# Altium project Shield.PrjPCB
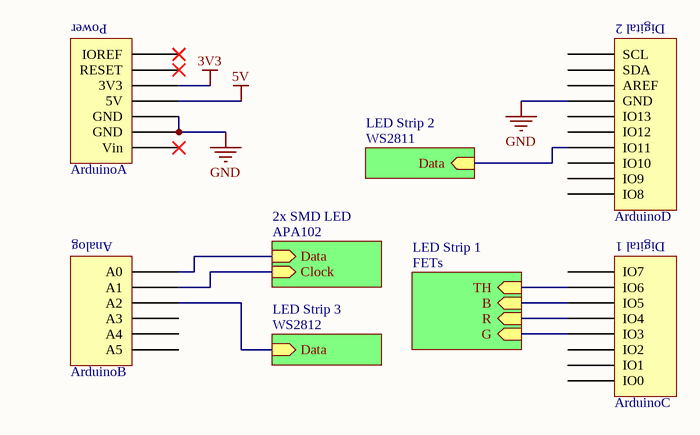
[diagram p0: Top.SchDoc]
5 sheets, 18 parts. Net scope: hierarchical (ports join the sheet entries above them; power ports are global).
Board file: Shield.PcbDoc
Sheets:
  Top.SchDoc
    2x SMD LED = APA102.SchDoc
    LED Strip 2 = WS2811.SchDoc
    LED Strip 1 = FETs.SchDoc
    LED Strip 3 = WS2812.SchDoc

## Sheet Top.SchDoc
size A4

### Parts
Arduino  Uno  [Arduino Uno]  (value not drawn)  (parts A,B,C,D of 5)

### Sub-sheets
2x SMD LED = APA102: Data (in), Clock (in)
LED Strip 1 = FETs: B (in), G (in), R (in), TH (in)
LED Strip 2 = WS2811: Data (in)
LED Strip 3 = WS2812: Data (in)

### Nets
3V3: Arduino.3V3
5V: Arduino.5V
GND: Arduino.GND1(GND) Arduino.GND2(GND) Arduino.GND3(GND)
APA102-Clock: Arduino.A1 ; sheet 2x SMD LED/Clock
APA102-Data: Arduino.A0 ; sheet 2x SMD LED/Data
Gate-B: Arduino.5(IO5) ; sheet LED Strip 1/B
Gate-G: Arduino.3(IO3) ; sheet LED Strip 1/G
Gate-R: Arduino.4(IO4) ; sheet LED Strip 1/R
Gate-TH: Arduino.6(IO6) ; sheet LED Strip 1/TH
WS2811-Data: Arduino.11(IO11) ; sheet LED Strip 2/Data
NetArduino_A2: Arduino.A2 ; sheet LED Strip 3/Data

Not connected (* = marked no-connect by the designer): Arduino 0(IO0) 1(IO1) 2(IO2) 7(IO7) 8(IO8) 9(IO9) 10(IO10) 12(IO12) 13(IO13) A3 A4 A5 AREF IOREF* RESET* SCL SDA Vin*

### Notes on the sheet
- (in symbol Arduino Uno, part A) Power
- (in symbol Arduino Uno, part B) Analog
- (in symbol Arduino Uno, part C) Digital 1
- (in symbol Arduino Uno, part D) Digital 2
- (in symbol Arduino Uno, part E) ICSP

### Library data of the parts
Arduino = Arduino Uno

## Sheet APA102.SchDoc
size A4
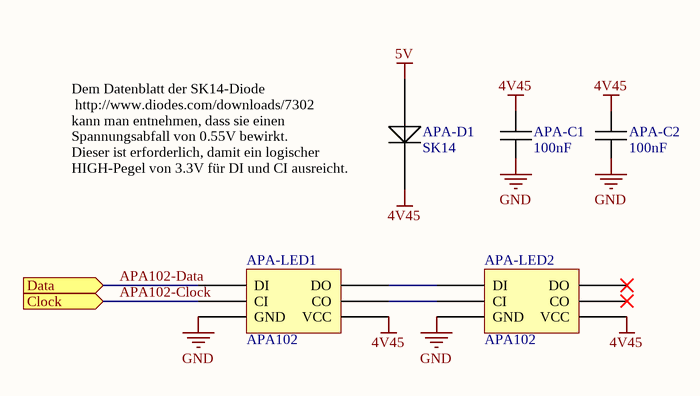
[diagram p1: APA102.SchDoc]

### Parts
APA-C1  100nF  [C 0805 wide]
APA-C2  100nF  [C 0805 wide]
APA-D1  SK14  [SC-90]
APA-LED1  APA102  [LED SMD 5x5mm]
APA-LED2  APA102  [LED SMD 5x5mm]

### Ports
Clock (in), Data (in)

### Nets
4V45: APA-C1.1 APA-C2.1 APA-D1.1 APA-LED1.4(VCC) APA-LED2.4(VCC)
5V: APA-D1.2
GND: APA-C1.2 APA-C2.2 APA-LED1.3(GND) APA-LED2.3(GND)
APA102-Clock: APA-LED1.2(CI) ; port Clock
APA102-Data: APA-LED1.1(DI) ; port Data
NetAPA-LED1_5: APA-LED1.5(CO) APA-LED2.2(CI)
NetAPA-LED1_6: APA-LED1.6(DO) APA-LED2.1(DI)

Not connected (* = marked no-connect by the designer): APA-LED2 5(CO)* 6(DO)*

### Notes on the sheet
- (near APA-D1) Dem Datenblatt der SK14-Diode
  http://www.diodes.com/downloads/7302
  kann man entnehmen, dass sie einen
  Spannungsabfall von 0.55V bewirkt.
  Dieser ist erforderlich, damit ein logischer
  HIGH-Pegel von 3.3V für DI und CI ausreicht.

### Library data of the parts
APA-C1 APA-C2 = Capacitor
APA-D1 = Diode

## Sheet WS2811.SchDoc
size A4
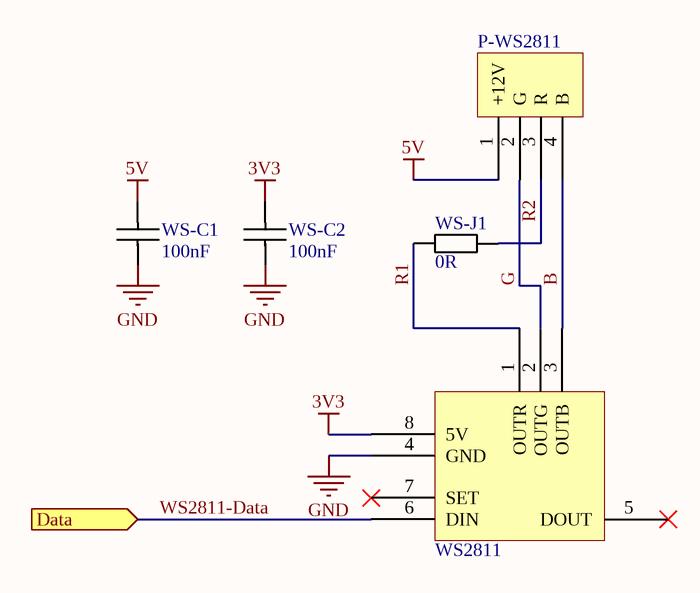
[diagram p2: WS2811.SchDoc]

### Parts
P-WS2811  LED strip RGB  [LED strip RGB connector]  (value not drawn)
WS2811  WS2811S  [SOIC-8]  (value not drawn)
WS-C1  100nF  [C 0805 / 2012]
WS-C2  100nF  [C 0805 / 2012]
WS-J1  0R  [R 0805 / 2012 wide]

### Ports
Data (in)

### Nets
3V3: WS2811.8(5V) WS-C2.1
5V: P-WS2811.1(+12V) WS-C1.1
GND: WS2811.4(GND) WS-C1.2 WS-C2.2
B: P-WS2811.4(B) WS2811.3(OUTB)
G: P-WS2811.2(G) WS2811.2(OUTG)
R1: WS2811.1(OUTR) WS-J1.1
R2: P-WS2811.3(R) WS-J1.2
WS2811-Data: WS2811.6(DIN) ; port Data

Not connected (* = marked no-connect by the designer): WS2811 5(DOUT)* 7(SET)*

### Library data of the parts
WS2811 = WS2811S: RGB LED Controller
WS-C1 WS-C2 = Capacitor
WS-J1 = Resistor

## Sheet FETs.SchDoc
size A4
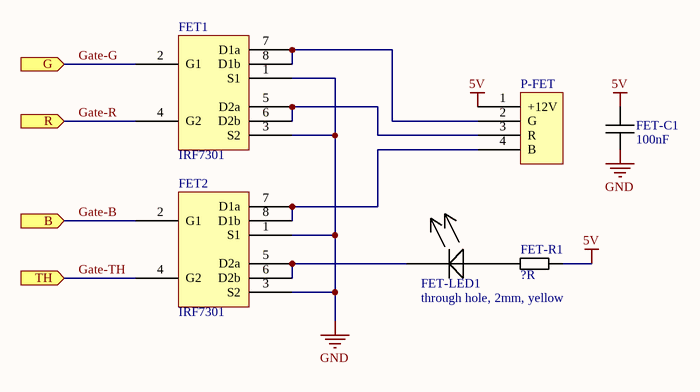
[diagram p3: FETs.SchDoc]

### Parts
FET1  IRF7301  [SOIC-8]
FET2  IRF7301  [SOIC-8]
FET-C1  100nF  [C 0805 / 2012]
FET-LED1  through hole, 2mm, yellow  [LED 3mm]
FET-R1  ?R  [R 0805 / 2012]
P-FET  LED strip RGB  [LED strip RGB connector]  (value not drawn)

### Ports
B (in), G (in), R (in), TH (in)

### Nets
5V: FET-C1.1 FET-R1.2 P-FET.1(+12V)
GND: FET1.1(S1) FET1.3(S2) FET2.1(S1) FET2.3(S2) FET-C1.2
Gate-B: FET2.2(G1) ; port B
Gate-G: FET1.2(G1) ; port G
Gate-R: FET1.4(G2) ; port R
Gate-TH: FET2.4(G2) ; port TH
NetFET1_5: FET1.5(D2a) FET1.6(D2b) P-FET.3(R)
NetFET1_7: FET1.7(D1a) FET1.8(D1b) P-FET.2(G)
NetFET2_5: FET2.5(D2a) FET2.6(D2b) FET-LED1.2(-)
NetFET2_7: FET2.7(D1a) FET2.8(D1b) P-FET.4(B)
NetFET-LED1_1: FET-LED1.1(+) FET-R1.1

### Library data of the parts
FET-C1 = Capacitor
FET-LED1 = LED
FET-R1 = Resistor

## Sheet WS2812.SchDoc
size A4
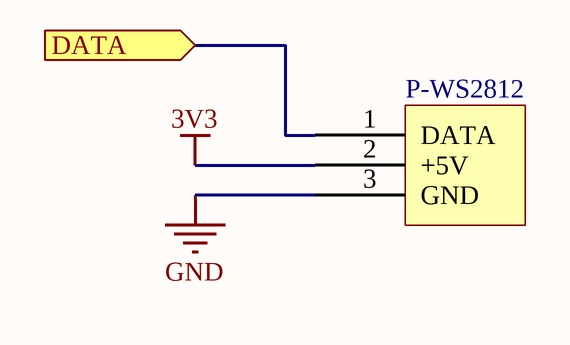
[diagram p4: WS2812.SchDoc]

### Parts
P-WS2812  Addressable LED Strip Connector  [LED strip 3 pads]  (value not drawn)

### Ports
DATA (in)

### Nets
3V3: P-WS2812.2(+5V)
GND: P-WS2812.3(GND)
NetArduino_A2: P-WS2812.1(DATA) ; port DATA

### Library data of the parts
P-WS2812 = LED strip WS2812

## Nets that join several sheets
3V3: Top (Arduino.3V3), WS2811 (WS2811.8 WS-C2.1), WS2812 (P-WS2812.2)
5V: Top (Arduino.5V), APA102 (APA-D1.2), WS2811 (P-WS2811.1 WS-C1.1), FETs (FET-C1.1 FET-R1.2 P-FET.1)
GND: Top (Arduino.GND1 Arduino.GND2 Arduino.GND3), APA102 (APA-C1.2 APA-C2.2 APA-LED1.3 APA-LED2.3), WS2811 (WS2811.4 WS-C1.2 WS-C2.2), FETs (5 pins), WS2812 (P-WS2812.3)
APA102-Clock: Top (Arduino.A1), APA102 (APA-LED1.2)
APA102-Data: Top (Arduino.A0), APA102 (APA-LED1.1)
Gate-B: Top (Arduino.5), FETs (FET2.2)
Gate-G: Top (Arduino.3), FETs (FET1.2)
Gate-R: Top (Arduino.4), FETs (FET1.4)
Gate-TH: Top (Arduino.6), FETs (FET2.4)
NetArduino_A2: Top (Arduino.A2), WS2812 (P-WS2812.1)
WS2811-Data: Top (Arduino.11), WS2811 (WS2811.6)